# Altium schematic sheet DM1097_Power_Supply.SchDoc: =project_title (part 1 of 3)
size Tabloid; PageSetup: Record=PageOptions|CenterHorizontal=True|CenterVertical=True|PrintScale=0.73|XCorrection=1.00|YCorrection=1.00|PrintKind=0|BorderSize=5000000|LeftOffset=0|BottomOffset=0|Orientation=2|PaperLength=1000|PaperWidth=1000|Scale=100|PaperSource=7|PrintQuality=-4|MediaType=1|DitherType=10|PaperKind=A4|PrintScaleMode=1; CompanyName: Luxonis Holding; Organization: Luxonis Holding; Address1: 1925 Harmony Park Drive; Address2: Westminster, CO; Address3: 80234; Address4: United States; SheetNumber: 7; SheetTotal: 17
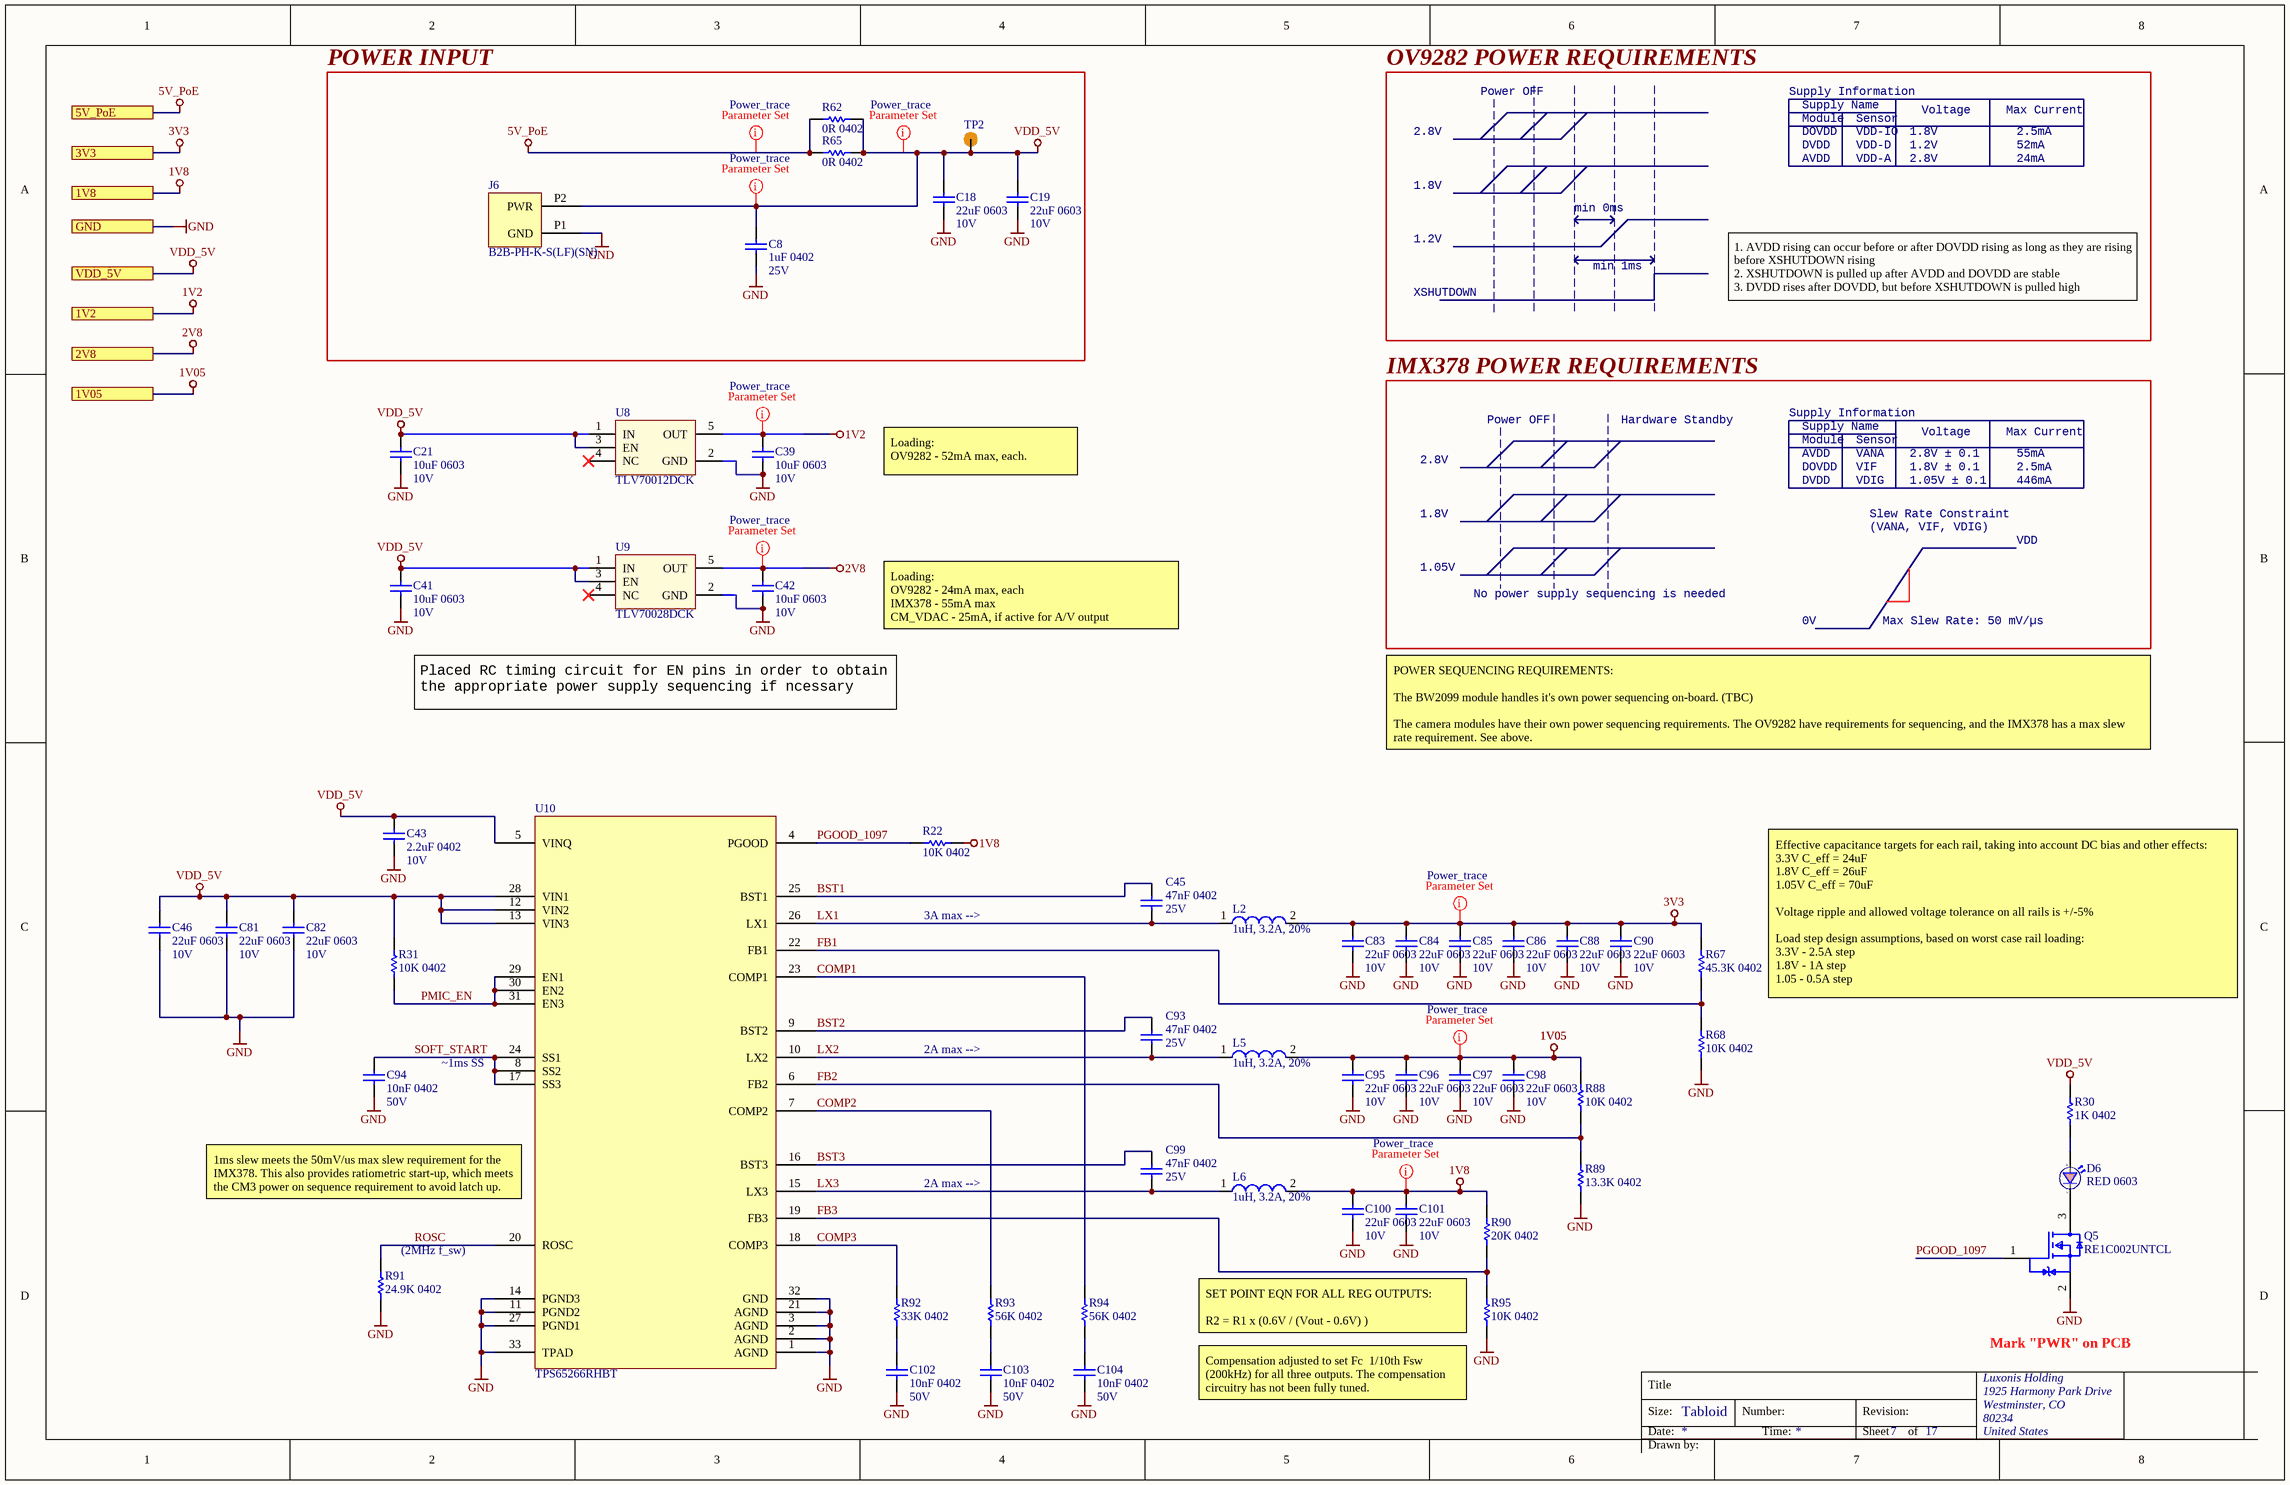
[diagram p0: DM1097_Power_Supply.SchDoc]

## Parts
C8  1uF 0402  Voltage Rating: 25V  [CAPC0402(1005)70_L]
C18  22uF 0603  Voltage Rating: 10V  [CAPC0603(1608)100_L]
C19  22uF 0603  Voltage Rating: 10V  [CAPC0603(1608)100_L]
C21  10uF 0603  Voltage Rating: 10V  [CAPC0603(1608)100_N]
C39  10uF 0603  Voltage Rating: 10V  [CAPC0603(1608)100_N]
C41  10uF 0603  Voltage Rating: 10V  [CAPC0603(1608)100_N]
C42  10uF 0603  Voltage Rating: 10V  [CAPC0603(1608)100_N]
C43  2.2uF 0402  Voltage Rating: 10V  [CAPC0402(1005)70_N]
C45  47nF 0402  Voltage: 25V  [CAPC0402(1005)70_N]
C46  22uF 0603  Voltage Rating: 10V  [CAPC0603(1608)100_N]
C81  22uF 0603  Voltage Rating: 10V  [CAPC0603(1608)100_N]
C82  22uF 0603  Voltage Rating: 10V  [CAPC0603(1608)100_N]
C83  22uF 0603  Voltage Rating: 10V  [CAPC0603(1608)100_N]
C84  22uF 0603  Voltage Rating: 10V  [CAPC0603(1608)100_N]
C85  22uF 0603  Voltage Rating: 10V  [CAPC0603(1608)100_N]
C86  22uF 0603  Voltage Rating: 10V  [CAPC0603(1608)100_N]
C88  22uF 0603  Voltage Rating: 10V  [CAPC0603(1608)100_N]
C90  22uF 0603  Voltage Rating: 10V  [CAPC0603(1608)100_N]
C93  47nF 0402  Voltage: 25V  [CAPC0402(1005)70_N]
C94  10nF 0402  Voltage Rating: 50V  [CAPC0402(1005)60_N]
C95  22uF 0603  Voltage Rating: 10V  [CAPC0603(1608)100_N]
C96  22uF 0603  Voltage Rating: 10V  [CAPC0603(1608)100_N]
C97  22uF 0603  Voltage Rating: 10V  [CAPC0603(1608)100_N]
C98  22uF 0603  Voltage Rating: 10V  [CAPC0603(1608)100_N]
C99  47nF 0402  Voltage: 25V  [CAPC0402(1005)70_N]
C100  22uF 0603  Voltage Rating: 10V  [CAPC0603(1608)100_N]
C101  22uF 0603  Voltage Rating: 10V  [CAPC0603(1608)100_N]
C102  10nF 0402  Voltage Rating: 50V  [CAPC0402(1005)60_N]
C103  10nF 0402  Voltage Rating: 50V  [CAPC0402(1005)60_N]
C104  10nF 0402  Voltage Rating: 50V  [CAPC0402(1005)60_N]
D6  RED 0603  [SML_D1xx8W]
J6  B2B-PH-K-S(LF)(SN)  [B2B-PH-K-S(LF)(SN)]
L2  1uH, 3.2A, 20%  [DFE252012P-1R0M=P2]
L5  1uH, 3.2A, 20%  [DFE252012P-1R0M=P2]
L6  1uH, 3.2A, 20%  [DFE252012P-1R0M=P2]
Q5  RE1C002UNTCL  [RE1C002UNTCL]
R22  10K 0402  [RESC0402(1005)_N]
R30  1K 0402  [RESC0402(1005)_N]
R31  10K 0402  [RESC0402(1005)_N]
R62  0R 0402  [RESC0402(1005)_N]
R65  0R 0402  [RESC0402(1005)_N]
R67  45.3K 0402  [RESC0402(1005)_N]
R68  10K 0402  [RESC0402(1005)_N]
R88  10K 0402  [RESC0402(1005)_N]
R89  13.3K 0402  [RESC0402(1005)_N]
R90  20K 0402  [RESC0402(1005)_N]
R91  24.9K 0402  [RESC0402(1005)_N]
R92  33K 0402  [RESC0402(1005)_N]
R93  56K 0402  [RESC0402(1005)_N]
R94  56K 0402  [RESC0402(1005)_N]
R95  10K 0402  [RESC0402(1005)_N]
TP2  TP100_200_NS  [TP100_200_NS]  (value not drawn)  (no BOM)
U8  TLV70012DCK  [TLV70012DCK]
U9  TLV70028DCK  [TLV70028DCK]
U10  TPS65266RHBT  [TPS65266RHBT]

## Blocks framed on the sheet
POWER INPUT: C8 C18 C19 J6 R62 R65 TP2

## Ports
1V2, 1V05, 1V8, 2V8, 3V3, 5V_PoE, GND, VDD_5V

## Nets
1V2: C39.2 U8.5(OUT) ; port 1V2
1V05: C95.1 C96.1 C97.1 C98.1 L5.2 R88.2 ; port 1V05
1V8: C100.1 C101.1 L6.2 R22.2 R90.2 ; port 1V8
2V8: C42.2 U9.5(OUT) ; port 2V8
3V3: C83.1 C84.1 C85.1 C86.1 C88.1 C90.1 L2.2 R67.2 ; port 3V3
5V_PoE: R62.2 R65.2 ; port 5V_PoE
GND: C8.1 C18.1 C19.1 C21.1 C39.1 C41.1 C42.1 C43.2 C46.2 C81.2 C82.2 C83.2 C84.2 C85.2 C86.2 C88.2 C90.2 C94.2 C95.2 C96.2 C97.2 C98.2 C100.2 C101.2 C102.2 C103.2 C104.2 J6.P1(GND) Q5.2(Source) R68.1 R89.1 R91.1 R95.1 U8.2(GND) U9.2(GND) U10.1(AGND) U10.2(AGND) U10.3(AGND) U10.11(PGND2) U10.14(PGND3) U10.21(AGND) U10.27(PGND1) U10.32(GND) U10.33(TPAD) ; port GND
VDD_5V: C8.2 C18.2 C19.2 C21.2 C41.2 C43.1 C46.1 C81.1 C82.1 J6.P2(PWR) R30.2 R31.2 R62.1 R65.1 TP2.1 U8.1(IN) U8.3(EN) U9.1(IN) U9.3(EN) U10.5(VINQ) U10.12(VIN2) U10.13(VIN3) U10.28(VIN1) ; port VDD_5V
BST1: C45.1 U10.25(BST1)
BST2: C93.1 U10.9(BST2)
BST3: C99.1 U10.16(BST3)
COMP1: R94.2 U10.23(COMP1)
COMP2: R93.2 U10.7(COMP2)
COMP3: R92.2 U10.18(COMP3)
FB1: R67.1 R68.2 U10.22(FB1)
FB2: R88.1 R89.2 U10.6(FB2)
FB3: R90.1 R95.2 U10.19(FB3)
LX1: C45.2 L2.1 U10.26(LX1)
LX2: C93.2 L5.1 U10.10(LX2)
LX3: C99.2 L6.1 U10.15(LX3)
PGOOD_1097: Q5.1(Gate) R22.1 U10.4(PGOOD)
PMIC_EN: R31.1 U10.29(EN1) U10.30(EN2) U10.31(EN3)
ROSC: R91.2 U10.20(ROSC)
SOFT_START: C94.1 U10.8(SS2) U10.17(SS3) U10.24(SS1)
NetC102_1: C102.1 R92.1
NetC103_1: C103.1 R93.1
NetC104_1: C104.1 R94.1
NetD6_1: D6.1(C) Q5.3(Drain)
NetD6_2: D6.2(A) R30.1

Not connected (* = marked no-connect by the designer): U8 4(NC)*; U9 4(NC)*

## Layout directives
net class Power_trace: 1V2, 1V05, 1V8, 2V8, 3V3, 5V_PoE, VDD_5V

## Notes on the sheet
- OV9282 POWER REQUIREMENTS
- Power OFF
- Supply Information
- 2.8V
- AVDD
- DOVDD
- DVDD
- Supply Name
- Module
- VDD-A
- VDD-IO
- VDD-D
- Sensor
- 1.8V
- 1.2V
- Voltage
- Max Current
- 24mA
- 2.5mA
- 52mA
- min 0ms
- XSHUTDOWN
- min 1ms
- 1. AVDD rising can occur before or after DOVDD rising as long as they are rising before XSHUTDOWN rising
  2. XSHUTDOWN is pulled up after AVDD and DOVDD are stable
  3. DVDD rises after DOVDD, but before XSHUTDOWN is pulled high
- IMX378 POWER REQUIREMENTS
- Hardware Standby
- Loading:
  OV9282 - 52mA max, each.
- VANA
- VIF
- VDIG
- 2.8V ± 0.1
- 1.8V ± 0.1
- 1.05V ± 0.1
- 55mA
- 446mA
- 1.05V
- Slew Rate Constraint
- (VANA, VIF, VDIG)
- VDD
- Loading:
  OV9282 - 24mA max, each
  IMX378 - 55mA max
  CM_VDAC - 25mA, if active for A/V output
- No power supply sequencing is needed
- 0V
- Max Slew Rate: 50 mV/µs
- Placed RC timing circuit for EN pins in order to obtain the appropriate power supply sequencing if ncessary
- POWER SEQUENCING REQUIREMENTS:
  The BW2099 module handles it's own power sequencing on-board. (TBC)
  The camera modules have their own power sequencing requirements. The OV9282 have requirements for sequencing, and the IMX378 has a max slew rate requirement. See above.
- 3A max -->
- Effective capacitance targets for each rail, taking into account DC bias and other effects:
  3.3V C_eff = 24uF
  1.8V C_eff = 26uF
  1.05V C_eff = 70uF
  Voltage ripple and allowed voltage tolerance on all rails is +/-5%
  Load step design assumptions, based on worst case rail loading:
  3.3V - 2.5A step
  1.8V - 1A step
  1.05 - 0.5A step
- ~1ms SS
- 2A max -->
- (near U10) 1ms slew meets the 50mV/us max slew requirement for the IMX378. This also provides ratiometric start-up, which meets the CM3 power on sequence requirement to avoid latch up.
- (near R91) (2MHz f_sw)
- (near R95) SET POINT EQN FOR ALL REG OUTPUTS:
  R2 = R1 x (0.6V / (Vout - 0.6V) )
- Mark "PWR" on PCB
- (near R95) Compensation adjusted to set Fc  1/10th Fsw  (200kHz) for all three outputs. The compensation circuitry has not been fully tuned.
- Title
- Size:
- Date:
- Tabloid
- Number:
- Time:
- Revision:
- Sheet
- of
- Drawn by: